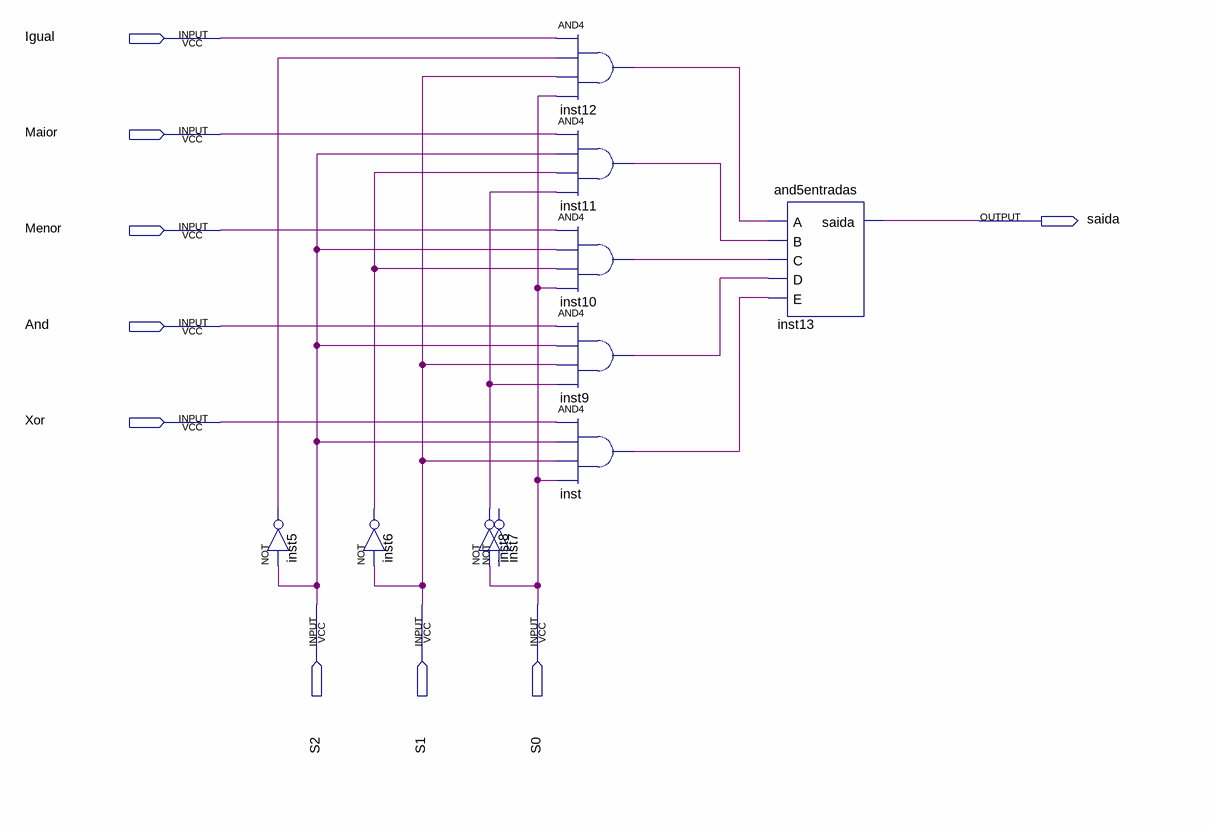
[diagram p0: schematic sheet]
// Quartus schematic mux_status.bdf as structural Verilog: 10 symbols, 9 pins
module mux_status (
  input  Igual,
  input  Maior,
  input  Menor,
  input  And,
  input  Xor,
  input  S2,
  input  S1,
  input  S0,
  output saida
);

  wire inst5_out, inst6_out, inst8_out, inst9_out, inst10_out, inst11_out, inst12_out, inst_out;

  not inst5 (inst5_out, S2);
  not inst6 (inst6_out, S1);
  // NOT inst7 is placed but not wired
  not inst8 (inst8_out, S0);
  and inst12 (inst12_out, Igual, inst5_out, S1, S0);
  and inst11 (inst11_out, Maior, S2, inst6_out, inst8_out);
  and inst10 (inst10_out, Menor, S2, inst6_out, S0);
  and inst9 (inst9_out, And, S2, S1, inst8_out);
  and inst (inst_out, Xor, S2, S1, S0);
  and5entradas inst13 (.A(inst12_out), .B(inst11_out), .C(inst10_out), .D(inst9_out), .E(inst_out), .saida(saida));
endmodule
